# Altium project Converter.PrjPCB
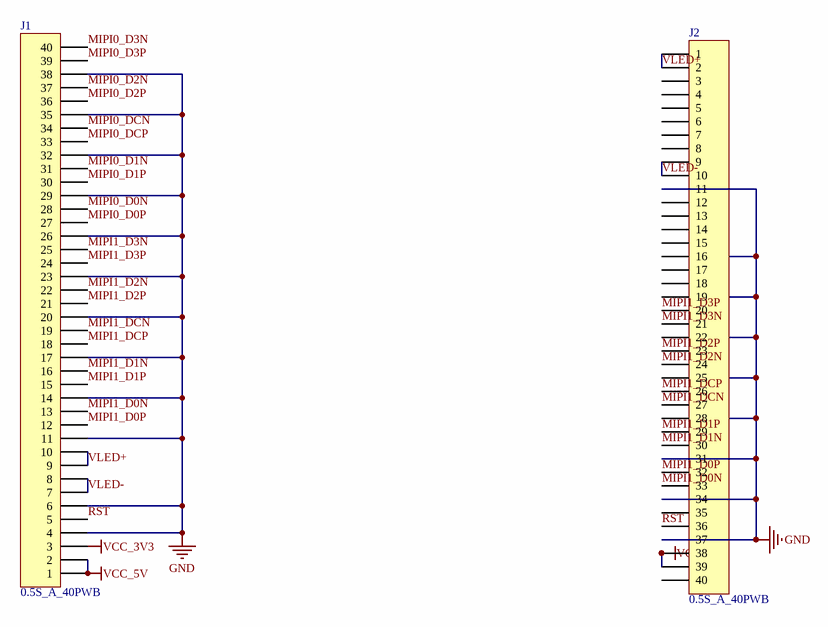
[diagram p0: Main.SchDoc]
1 sheet, 2 parts. Net scope: global (net labels, ports and power ports of the same name join across sheets).
Board file: Converter.PcbDoc

## Sheet Main.SchDoc
size A4

### Parts
J1  0.5S_A_40PWB  [FFC_0.5_40]
J2  0.5S_A_40PWB  [FFC_0.5_40]

### Nets
GND: J1.4 J1.6 J1.11 J1.14 J1.17 J1.20 J1.23 J1.26 J1.29 J1.32 J1.35 J1.38 J2.11 J2.16 J2.19 J2.22 J2.25 J2.28 J2.31 J2.34 J2.37
VCC_3V3: J1.3 J2.38 J2.39
VCC_5V: J1.1 J1.2
MIPI0_D0N: J1.28
MIPI0_D0P: J1.27
MIPI0_D1N: J1.31
MIPI0_D1P: J1.30
MIPI0_D2N: J1.37
MIPI0_D2P: J1.36
MIPI0_D3N: J1.40
MIPI0_D3P: J1.39
MIPI0_DCN: J1.34
MIPI0_DCP: J1.33
MIPI1_D0N: J1.13 J2.33
MIPI1_D0P: J1.12 J2.32
MIPI1_D1N: J1.16 J2.30
MIPI1_D1P: J1.15 J2.29
MIPI1_D2N: J1.22 J2.24
MIPI1_D2P: J1.21 J2.23
MIPI1_D3N: J1.25 J2.21
MIPI1_D3P: J1.24 J2.20
MIPI1_DCN: J1.19 J2.27
MIPI1_DCP: J1.18 J2.26
RST: J1.5 J2.36
VLED+: J1.9 J1.10 J2.1 J2.2
VLED-: J1.7 J1.8 J2.9 J2.10

Not connected (* = marked no-connect by the designer): J2 3 4 5 6 7 8 12 13 14 15 17 18 35 40

### Library data of the parts
J1 J2 = FPC40-0.5mm: Header, 40-Pin; LatestRevisionDate: 17-Jul-2002; LatestRevisionNote: Re-released for DXP Platform.; Publisher: Altium Limited